# EAGLE design receiver (EAGLE 7.4.0)
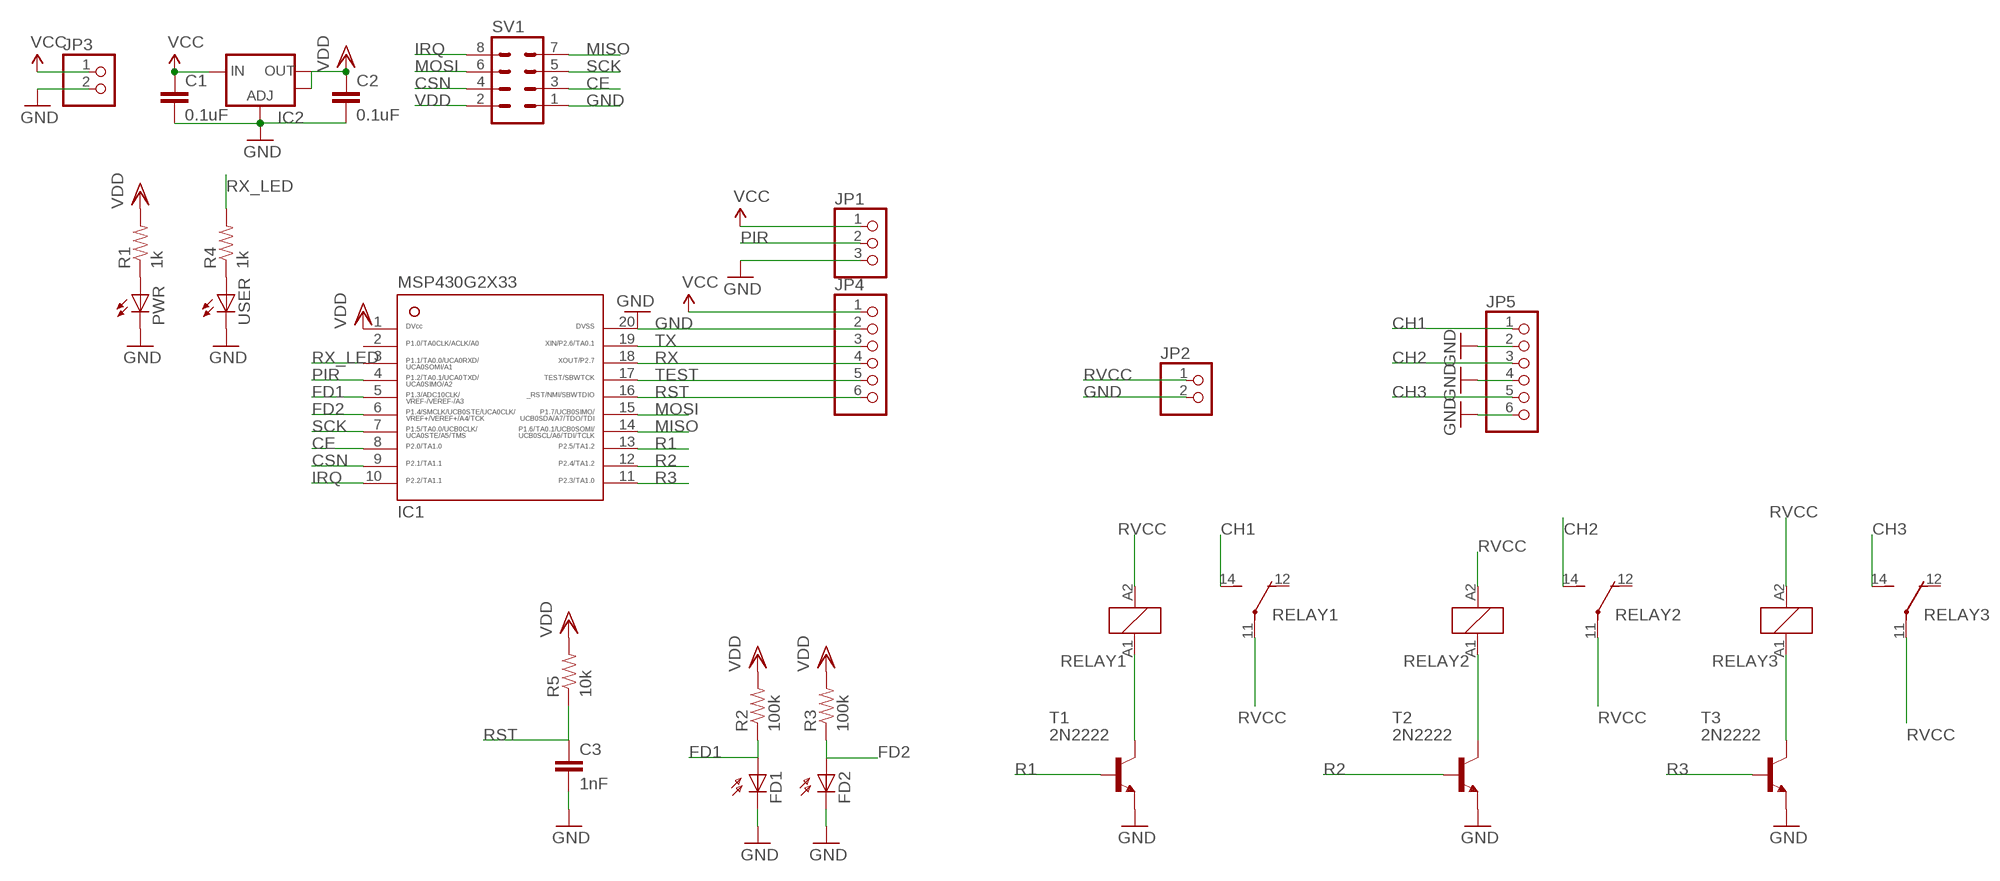
[diagram p0: schematic, sheet 1]

## Parts
C1  0.1uF  0.1UF-25V(+80/-20%)(0603)  [0603-CAP]
C2  0.1uF  0.1UF-25V(+80/-20%)(0603)  [0603-CAP]
C3  1nF  0.1UF-25V(+80/-20%)(0603)  [0603-CAP]
FD1  BPX65  [BPX65]
FD2  BPX65  [BPX65]
IC1  MSP430G2X33-20PW20  [PW20]
IC2  V_REG_LM1117SOT223  [SOT223]
JP1  PINHD-1X3  [1X03]
JP2  PINHD-1X2  [1X02]
JP3  PINHD-1X2  [1X02]
JP4  PINHD-1X6  [1X06]
JP5  PINHD-1X6  [1X06]
PWR  LEDCHIP-LED0805  [CHIP-LED0805]
R1  1k  0OHM1/10W5%(0603)  [0603]
R2  100k  0OHM1/10W5%(0603)  [0603]
R3  100k  0OHM1/10W5%(0603)  [0603]
R4  1k  0OHM1/10W5%(0603)  [0603]
R5  10k  0OHM1/10W5%(0603)  [0603]
RELAY1  ZNS5106  [ZN5]
RELAY2  ZNS5106  [ZN5]
RELAY3  ZNS5106  [ZN5]
SV1  MA04-2  [MA04-2]
T1  2N2222  [TO92-EBC-OVAL]
T2  2N2222  [TO92-EBC-OVAL]
T3  2N2222  [TO92-EBC-OVAL]
USER  LEDCHIP-LED0805  [CHIP-LED0805]

## Nets
CE: IC1.8 SV1.3
CH1: JP5.1 RELAY1.14(2:S)
CH2: JP5.3 RELAY2.14(2:S)
CH3: JP5.5 RELAY3.14(2:S)
CSN: IC1.9 SV1.4
FD1: FD1.A IC1.5 R2.1
FD2: FD2.A IC1.6 R3.1
GND: C1.2 C2.2 C3.2 FD1.K(C) FD2.K(C) IC1.20 IC2.1(ADJ) JP1.3 JP2.2 JP3.2 JP4.2 JP5.2 JP5.4 JP5.6 PWR.C SV1.1 T1.E T2.E T3.E USER.C
IRQ: IC1.10 SV1.8
MISO: IC1.14 SV1.7
MOSI: IC1.15 SV1.6
N$2: RELAY2.A1 T2.C
N$3: RELAY3.A1 T3.C
N$4: PWR.A R1.1
N$9: R4.1 USER.A
N$10: RELAY1.A1 T1.C
PIR: IC1.4 JP1.2
R1: IC1.13 T1.B
R2: IC1.12 T2.B
R3: IC1.11 T3.B
RST: C3.1 IC1.16 JP4.6 R5.1
RVCC: JP2.1 RELAY1.11(2:P) RELAY1.A2 RELAY2.11(2:P) RELAY2.A2 RELAY3.11(2:P) RELAY3.A2
RX: IC1.18 JP4.4
RX_LED: IC1.3 R4.2
SCK: IC1.7 SV1.5
TEST: IC1.17 JP4.5
TX: IC1.19 JP4.3
VCC: C1.1 IC2.3(IN) JP1.1 JP3.1 JP4.1
VDD: C2.1 IC1.1 IC2.2(OUT) IC2.4(OUT) R1.2 R2.2 R3.2 R5.2 SV1.2
Unconnected: IC1.2 RELAY1.12(2:O) RELAY2.12(2:O) RELAY3.12(2:O)

## Library data of the parts
C1 C2 = SparkFun-Capacitors:0.1UF-25V(+80/-20%)(0603): CAP-00810 Ceramic Standard decoupling cap; PROD_ID: CAP-00810
C3 = SparkFun-Capacitors:0.1UF-25V(+80/-20%)(0603): CAP-00810 Ceramic Standard decoupling cap; PROD_ID: CAP-00810; VALUE: 0.1uF
FD1 FD2 = opto-trans-siemens:BPX65: PHOTO DIODE; MPN: BPX65.; OC_FARNELL: 327451; OC_NEWARK: 06WX2764
IC1 = ti_msp430:MSP430G2X33-20
IC2 = SparkFun-PowerIC:V_REG_LM1117: Voltage Regulator LM1117 Standard adjustable voltage regulator but in SMD form. Spark Fun Electronics SKU : COM-00595
JP1 = pinhead:PINHD-1X3: PIN HEADER
JP2 JP3 = pinhead:PINHD-1X2: PIN HEADER
JP4 JP5 = pinhead:PINHD-1X6: PIN HEADER
PWR USER = adafruit:LED: LED OSRAM: - CHIPLED LG R971, LG N971, LY N971, LG Q971, LY Q971, LO R971, LY R971 LH N974, LH R974 LS Q976, LO Q976, LY Q976 LO Q996 - Hyper CHIPLED LW Q18S LB Q993, LB Q99A, LB R99A - SideLED LS A670, LO A670, LY A670, LG A670, LP A670 LB A673, LV A673, LT A673, LW A673 LH A674 LY A675 LS A676, LA A676, LO A676, LY A676, LW A676 LS A679, LY A679, LG A679 - Hyper Micro SIDELED® LS Y876, LA Y876, LO Y876, LY Y876 LT Y87S - SmartLED LW L88C, LW L88S LB L89C, LB L89S, LG L890 LS L89K, LO L89K, LY L89K LS L896, LA L896, LO L896, LY L896 - TOPLED LS T670, LO T670, LY T670, LG T670, LP T670 LSG T670, LSP T670, LSY T670, LOP T670, LYG T670 LG T671, LOG T671, LSG T671 LB T673, LV T673, LT T673, LW T673 LH T674 LS T676, LA T676, LO T676, LY T676, LB T676, LH T676, LSB T676, LW T676 LB T67C, LV T67C, LT T67C, LS T67K, LO T67K, LY T67K, LW E67C LS E67B, LA E67B, LO E67B, LY E67B, LB E67C, LV E67C, LT E67C LW T67C LS T679, LY T679, LG T679 LS T770, LO T770, LY T770, LG T770, LP T770 LB T773, LV T773, LT T773, LW T773 LH T774 LS E675, LA E675, LY E675, LS T675 LS T776, LA T776, LO T776, LY T776, LB T776 LHGB T686 LT T68C, LB T68C - Hyper Mini TOPLED® LB M676 - Mini TOPLED Santana® LG M470 LS M47K, LO M47K, LY M47K Source: http://www.osram.convergy.de/
R1-R5 = SparkFun-Resistors:0OHM1/10W5%(0603): RES-08609; PROD_ID: RES-08609; VALUE: 0
RELAY1-RELAY3 = relay:ZNS5*: Miniature Power PCB Relay SCHRACK 1pole 10 A Source: http://www.schrack.com/.. 5847.pdf; OC_FARNELL: unknown; OC_NEWARK: unknown
SV1 = con-lstb:MA04-2: PIN HEADER; OC_FARNELL: unknown; OC_NEWARK: unknown
T1-T3 = adafruit:2N2222: NPN TRANSISTOR Big oval pads

## Board
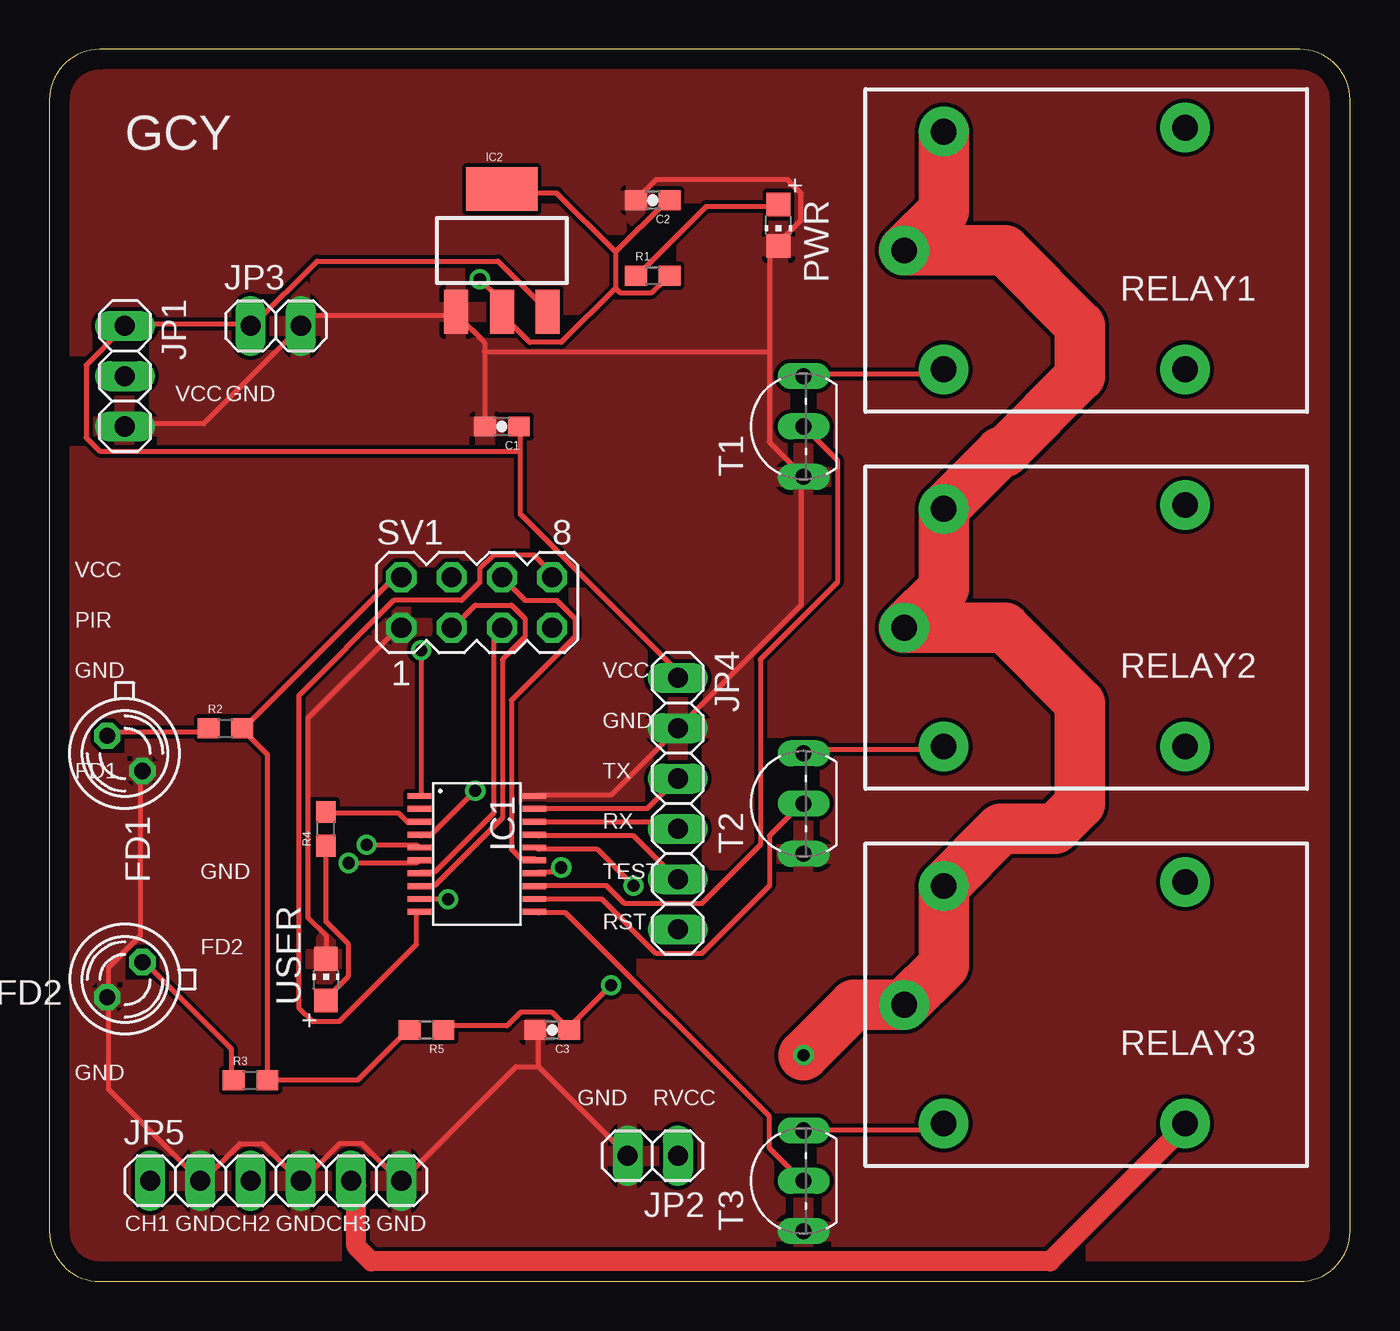
[diagram p1: board, top side]
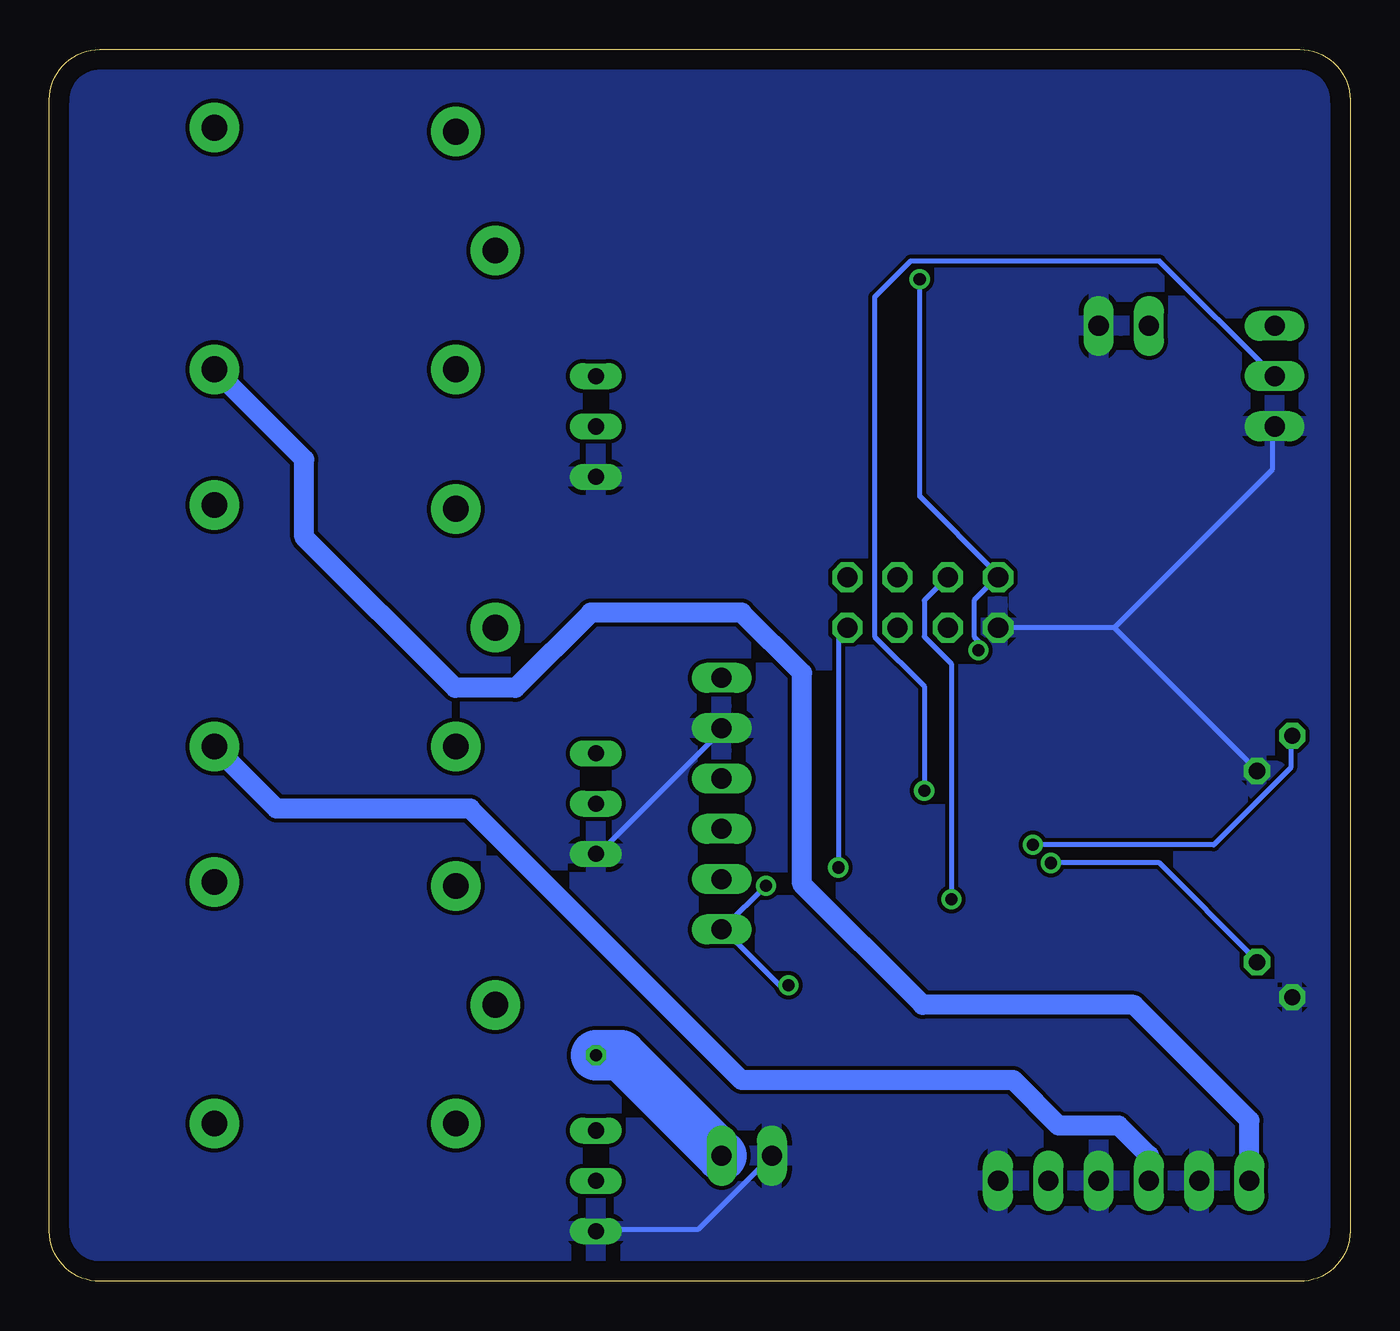
[diagram p2: board, bottom side, seen from below]

Size 65.71 x 62.22 mm. Coordinates in mm from the lower left corner, seen from the top.
Outline: 0,59.68 0,2.54 arc90 2.54,0 63.17,0 arc90 65.71,2.54 65.71,59.68 arc90 63.17,62.22 2.54,62.22 arc90 0,59.68
Copper layers (1*16): Top 0.035mm / dielectric 1.5mm / Bottom 0.035mm
Design rules "default": minimum track width 10mil, minimum drill 24mil, track to track 8mil, track to pad 8mil, pad to pad 8mil, via to via 8mil, smd to smd 8mil, copper to edge 40mil, drill to drill 8mil, minimum pad ring 10mil, minimum via ring 8mil, stop-mask expansion 4mil, vias tented up to drill 0mil, thermal gap 10mil

### Footprints (pad centres in the part's own frame; a part is rotated, then mirrored left to right if it is on the bottom)
0603-CAP = smd 1.1 x 1: 1 -0.85,0; 2 0.85,0
BPX65 = drill 0.813 octagon: A -0.889,-0.889; K 0.889,0.889
PW20 = smd 0.3 x 1.2: 1 -2.925,-2.9; 2 -2.275,-2.9; 3 -1.625,-2.9; 4 -0.975,-2.9; 5 -0.325,-2.9; 6 0.325,-2.9; 7 0.975,-2.9; 8 1.625,-2.9; 9 2.275,-2.9; 10 2.925,-2.9; 11 2.925,2.9; 12 2.275,2.9; 13 1.625,2.9; 14 0.975,2.9; 15 0.325,2.9; 16 -0.325,2.9; 17 -0.975,2.9; 18 -1.625,2.9; 19 -2.275,2.9; 20 -2.925,2.9
SOT223 = smd 1.219 x 2.235: 1 -2.311,-3.099; 2 0,-3.099; 3 2.311,-3.099 | smd 3.6 x 2.2: 4 0,3.099
1X03 = drill 1.016 long: 1 -2.54,0; 2 0,0; 3 2.54,0
1X02 = drill 1.016 long: 1 -1.27,0; 2 1.27,0
1X06 = drill 1.016 long: 1 -6.35,0; 2 -3.81,0; 3 -1.27,0; 4 1.27,0; 5 3.81,0; 6 6.35,0
CHIP-LED0805 = smd 1.2 x 1.2: A 0,-1.05; C 0,1.05
0603 = smd 1.1 x 1: 1 -0.85,0; 2 0.85,0
ZN5 = drill 1.3 pad 2.5: 11 8.89,0; 12 -5.31,-6.2; 14 -5.31,6; A1 6.89,6; A2 6.89,-6
MA04-2 = drill 1.016 octagon: 1 -3.81,-1.27; 2 -3.81,1.27; 3 -1.27,-1.27; 4 -1.27,1.27; 5 1.27,-1.27; 6 1.27,1.27; 7 3.81,-1.27; 8 3.81,1.27
TO92-EBC-OVAL = drill 0.813 long: B 0,-1.27; C 2.54,-1.27; E -2.54,-1.27

### Placement (x,y rotation side)
C1  22.86,43.18 180 top
C2  30.48,54.61 180 top
C3  25.4,12.7 180 top
FD1  3.81,26.67 270 top
FD2  3.81,15.24 180 top
IC1  21.59,21.59 270 top
IC2  22.86,52.07 0 top
JP1  3.81,45.72 270 top
JP2  30.48,6.35 180 top
JP3  11.43,48.26 0 top
JP4  31.75,24.13 270 top
JP5  11.43,5.08 0 top
PWR  36.83,53.34 180 top
R1  30.48,50.8 0 top
R2  8.89,27.94 0 top
R3  10.16,10.16 0 top
R4  13.97,22.86 90 top
R5  19.05,12.7 180 top
RELAY1  52.07,52.07 180 top
RELAY2  52.07,33.02 180 top
RELAY3  52.07,13.97 180 top
SV1  21.59,34.29 0 top
T1  36.83,43.18 90 top
T2  36.83,24.13 90 top
T3  36.83,5.08 90 top
USER  13.97,15.24 0 top

### Tracks (layer width: path | path; a pad name or v marks a point on that pad's centre or on a via)
CE
  Top 0.254: IC1.8 18.77,19.99 19.46,19.99 22.88,23.42 22.88,31.42 24.03,32.56 24.03,33.48 23.34,34.16 21.51,34.16 20.37,33.02 SV1.3
CH1
  Bottom 1.016: JP5.1 5.08,8.13 10.92,13.97 21.59,13.97 27.69,20.07 27.69,30.73 30.73,33.78 38.35,33.78 42.16,29.97 45.21,29.97 52.83,37.59 52.83,41.52 RELAY1.14
CH2
  Bottom 1.016: JP5.3 10.16,6.35 11.68,7.87 14.73,7.87 17.02,10.16 30.73,10.16 44.45,23.88 54.24,23.88 RELAY2.14
CH3
  Top 1.016: RELAY3.14 57.38,7.85 50.55,1.02 16.26,1.02 15.49,1.78 15.49,4.83 JP5.5
CSN  (via drill 0.61)
  Top 0.254: v20.14,19.3 18.77,19.3 IC1.9
  Bottom 0.254: v20.14,19.3 20.14,31.19 21.51,32.56 21.51,34.39 20.37,35.53 SV1.4
FD1  (via drill 0.61)
  Top 0.254: R2.1 8.03,27.76 3,27.76 FD1.A | v16.03,22.05 18.54,22.05 IC1.5
  Bottom 0.254: v16.03,22.05 6.88,22.05 3,25.93 3,27.53 FD1.A
FD2  (via drill 0.61)
  Top 0.254: R3.1 9.17,10.16 9.17,11.76 4.83,16.1 FD2.A | v15.11,21.13 18.54,21.13 IC1.6
  Bottom 0.254: v15.11,21.13 9.63,21.13 4.83,16.33 FD2.A
GND
  Top 0.254: IC1.20 24.71,24.56 28.37,24.56 JP4.2 37.97,34.16 37.97,40.56 T1.E 37.97,40.79 36.37,42.39 36.37,46.97 | C2.2 29.74,54.74 30.66,55.65 37.29,55.65 37.97,54.97 37.97,53.59 36.83,52.45 PWR.C 36.83,52.22 36.37,51.77 36.37,46.97 | 21.97,46.97 21.97,47.42 20.6,48.79 IC2.1 20.37,48.79 13.28,48.79 12.83,48.34 JP3.2 12.6,48.11 7.8,43.31 3.91,43.31 JP1.3 | 21.97,46.97 21.97,43.31 C1.2 | 24.71,10.85 24.71,12.68 C3.2 | JP2.2 24.71,10.85 | USER.C 13.97,17.48 13.06,18.39 13.06,28.45 17.63,33.02 SV1.1 | FD1.K 4.6,25.71 4.6,17.48 3,15.88 3,14.5 FD2.K 3,14.28 3,9.7 JP5.2 7.8,5.13 9.63,6.96 10.77,6.96 12.6,5.13 JP5.4 12.83,5.13 14.66,6.96 15.8,6.96 17.63,5.13 JP5.6 17.86,5.13 23.57,10.85 24.71,10.85 | 21.97,46.97 36.37,46.97
  Bottom 0.254: T2.E 37.97,21.59 31.8,27.76 JP4.2 | JP2.2 32.94,2.62 37.97,2.62 T3.E | 11.91,33.02 SV1.1 | 11.91,33.02 4.83,25.93 FD1.K | 11.91,33.02 3.91,41.02 3.91,43.08 JP1.3
  pour Top: 0.25,62.74 65.79,62.74 65.79,0.25 0.25,0.25
  pour Bottom: 2.54,62.74 65.79,62.74 65.79,0.25 0.25,0.25 0.25,62.74
IRQ
  Top 0.254: IC1.10 18.54,18.62 18.54,17.02 14.66,13.13 13.28,13.13 12.6,13.82 12.6,29.59 17.4,34.39 20.83,34.39 21.74,35.31 21.74,35.99 22.43,36.68 24.49,36.68 25.4,35.76 SV1.8
MISO  (via drill 0.61)
  Top 0.254: v25.86,20.9 25.63,20.68 24.71,20.68 IC1.14
  Bottom 0.254: v25.86,20.9 25.86,32.56 SV1.7
MOSI
  Top 0.254: SV1.6 24.03,34.39 25.63,34.39 26.54,33.48 26.54,32.56 23.34,29.36 23.34,21.82 23.8,21.36 24.49,21.36 IC1.15
N$2
  Top 0.254: T2.C 38.2,26.85 45.06,26.85 RELAY2.A1
N$3
  Top 0.254: T3.C 38.2,7.64 44.83,7.64 45.06,7.87 RELAY3.A1
N$4
  Top 0.254: R1.1 29.74,50.85 33.17,54.28 36.83,54.28 PWR.A
N$9
  Top 0.254: R4.1 13.97,18.16 15.11,17.02 15.11,15.42 13.97,14.28 USER.A
N$10
  Top 0.254: T1.C 38.2,45.82 44.83,45.82 45.06,46.05 RELAY1.A1
PIR  (via drill 0.61)
  Top 0.254: v21.51,24.79 19.23,22.5 18.77,22.5 IC1.4
  Bottom 0.254: v21.51,24.79 21.51,30.05 24.03,32.56 24.03,49.71 22.2,51.54 9.63,51.54 JP1.2
R1
  Top 0.254: T1.B 39.8,41.48 39.8,35.31 35.92,31.42 35.92,22.05 32.94,19.07 29.06,19.07 28.14,19.99 24.71,19.99 IC1.13
R2
  Top 0.254: IC1.12 24.71,19.3 27.91,19.3 30.66,16.56 32.94,16.56 36.37,19.99 36.37,22.5 37.97,24.11 T2.B
R3
  Top 0.254: IC1.11 24.71,18.62 26.09,18.62 36.37,8.33 36.37,6.73 37.97,5.13 T3.B
RST  (via drill 0.61)
  Top 0.254: R5.1 19.91,12.9 23.11,12.9 23.8,13.59 25.4,13.59 26.09,12.9 C3.1 26.31,12.9 v28.37,14.96 | v29.52,19.99 27.69,21.82 24.71,21.82 IC1.16
  Bottom 0.254: v29.52,19.99 31.57,17.93 JP4.6 31.57,17.7 28.83,14.96 v28.37,14.96
RVCC  (via drill 0.6)
  Top 2.54: RELAY1.A2 45.18,54.07 RELAY1.11 48.26,52.07 52.07,48.26 52.07,45.72 48.26,41.91 48.07,41.91 RELAY2.A2 45.18,35.02 RELAY2.11 48.26,33.02 52.07,29.21 52.07,24.13 50.8,22.86 48.07,22.86 RELAY3.A2 45.18,15.97 RELAY3.11 40.64,13.97 v38.1,11.43
  Bottom 2.54: v38.1,11.43 36.83,11.43 JP2.1
RX
  Top 0.254: IC1.18 24.71,23.19 31.34,23.19 31.57,22.96 JP4.4
RX_LED
  Top 0.254: R4.2 13.97,23.65 17.63,23.65 18.09,23.19 18.54,23.19 IC1.3
SCK
  Top 0.254: IC1.7 18.77,20.68 19.46,20.68 22.43,23.65 22.43,32.79 22.66,33.02 SV1.5
TEST
  Top 0.254: IC1.17 24.71,22.5 29.52,22.5 31.57,20.45 JP4.5
TX
  Top 0.254: IC1.19 24.71,23.88 30.2,23.88 31.57,25.25 JP4.3
VCC
  Top 0.254: 23.8,41.94 23.8,38.73 31.57,30.96 31.57,30.5 JP4.1 | 23.8,41.94 23.8,43.08 C1.1 | IC2.3 25.17,49.02 22.66,51.54 13.51,51.54 10.31,48.34 JP3.1 10.08,48.34 3.91,48.34 JP1.1 3.68,48.11 1.85,46.28 1.85,42.62 2.54,41.94 23.8,41.94
VDD  (via drill 0.61)
  Top 0.254: 28.6,50.17 28.83,49.94 30.43,49.94 31.12,50.62 R1.2 | 28.6,51.99 28.6,50.17 | 28.6,51.99 31.12,54.51 C2.1 | 28.6,50.17 25.86,47.42 24.26,47.42 22.88,48.79 IC2.2 22.66,49.02 22.66,49.71 v21.74,50.62 | 28.6,51.99 25.63,54.97 22.88,54.97 IC2.4 | R5.2 18.09,12.68 15.57,10.16 R3.2 11,10.16 11,26.62 9.85,27.76 R2.2 9.85,27.99 17.63,35.76 SV1.2 | v18.77,31.88 18.77,24.56 IC1.1
  Bottom 0.254: v18.77,31.88 18.77,32.33 19,32.56 19,34.39 17.86,35.53 SV1.2 17.86,35.76 21.74,39.65 v21.74,50.62

### Text on the board
tPlace: GCY | VCC | GND | VCC | PIR | GND | VCC | GND | FD1 | TX | RX | GND | TEST | RST | FD2 | GND | GND | RVCC | CH1 | GND | CH2 | GND | CH3 | GND